# Altium schematic sheet Analog Input.SchDoc
size A4; Author: Wojciech Grędel; DocumentNumber: 1; Revision: 1; SheetNumber: 1
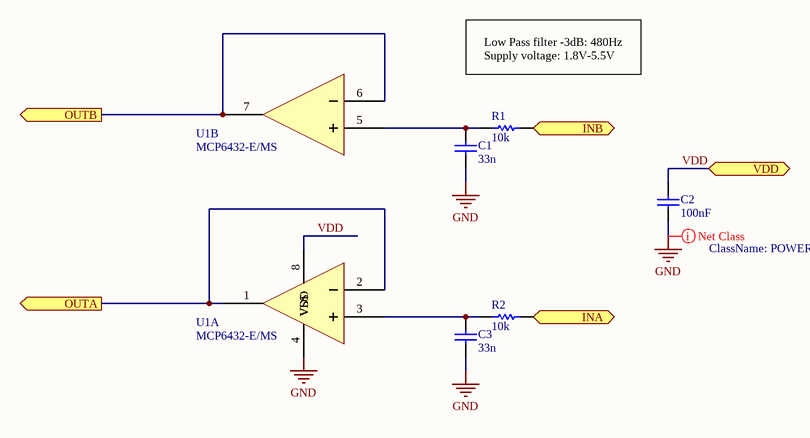
[diagram p0: Analog Input.SchDoc]

## Parts
C1  value 33n  [CAP_0603_IPC_HD]  (hidden comment: Cap)
C2  value 100nF  [CAP_0603_IPC_HD]  (hidden comment: Cap)
C3  value 33n  [CAP_0603_IPC_HD]  (hidden comment: Cap)
R1  value 10k  [RES_0603_IPC_HD]  (hidden comment: Res)
R2  value 10k  [RES_0603_IPC_HD]  (hidden comment: Res)
U1  MCP6432-E/MS  [MSOP8_IPC_MD]  (parts A,B of 2)

## Ports
INA (in), INB (in), OUTA (out), OUTB (out), VDD (bidir)

## Nets
GND: C1.1 C2.1 C3.1 U1.4(VSS)
INA: R2.2 ; port INA
INB: R1.2 ; port INB
OUTA: U1.1(VOUTA) U1.2(VINA-) ; port OUTA
OUTB: U1.6(VINB-) U1.7(VOUTB) ; port OUTB
VDD: C2.2 U1.8(VDD) ; port VDD
NetC1_2: C1.2 R1.1 U1.5(VINB+)
NetC3_2: C3.2 R2.1 U1.3(VINA+)

## Layout directives
net class POWER: GND

## Notes on the sheet
- Low Pass filter -3dB: 480Hz
  Supply voltage: 1.8V-5.5V
- Confidential / Not for distribution !
- Document name:
- Designer Name:
- Date/Time:
- Revision:

## Library data of the parts
C1-C3 = Cap: Capacitor
R1 R2 = Res: Resistor